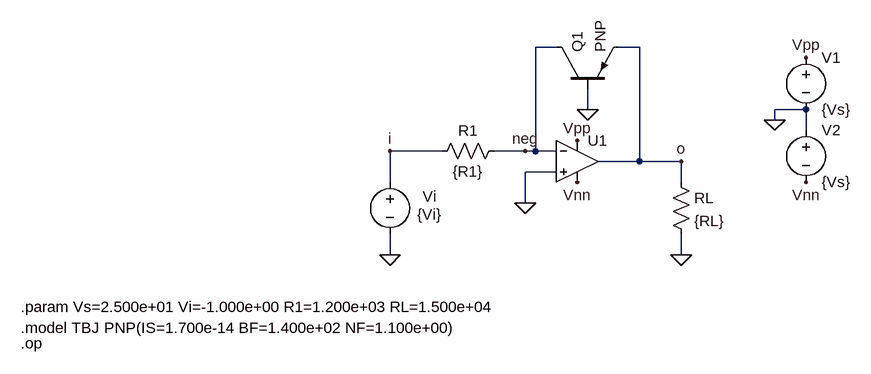
[diagram p0: schematic OPAMPTBJ02.asc]
OPAMPTBJ02.asc, the LTspice schematic file:
Version 4
SHEET 1 1608 1076
WIRE 672 240 640 240
WIRE 800 240 768 240
WIRE 720 336 720 304
WIRE 1056 336 1008 336
WIRE 1008 352 1008 336
WIRE 1056 368 1056 336
WIRE 496 400 416 400
WIRE 624 400 576 400
WIRE 640 400 640 240
WIRE 640 400 624 400
WIRE 672 400 640 400
WIRE 800 416 800 240
WIRE 800 416 736 416
WIRE 864 416 800 416
WIRE 672 432 624 432
WIRE 416 448 416 400
WIRE 864 448 864 416
WIRE 624 480 624 432
WIRE 416 560 416 528
WIRE 864 560 864 528
FLAG 1056 256 Vpp
FLAG 1008 352 0
FLAG 1056 448 Vnn
FLAG 864 560 0
FLAG 416 560 0
FLAG 704 384 Vpp
FLAG 704 448 Vnn
FLAG 624 480 0
FLAG 864 416 o
FLAG 416 400 i
FLAG 624 400 neg
FLAG 720 336 0
SYMBOL voltage 1056 240 R0
WINDOW 123 0 0 Left 0
WINDOW 39 0 0 Left 0
SYMATTR InstName V1
SYMATTR Value {Vs}
SYMBOL voltage 1056 352 R0
WINDOW 123 0 0 Left 0
WINDOW 39 0 0 Left 0
SYMATTR InstName V2
SYMATTR Value {Vs}
SYMBOL res 848 432 R0
SYMATTR InstName RL
SYMATTR Value {RL}
SYMBOL voltage 416 432 R0
WINDOW 3 42 66 Left 2
WINDOW 123 0 0 Left 0
WINDOW 39 0 0 Left 0
WINDOW 0 50 38 Left 2
SYMATTR Value {Vi}
SYMATTR InstName Vi
SYMBOL Opamps\\UniversalOpamp2 704 416 R0
SYMATTR InstName U1
SYMBOL res 480 416 R270
WINDOW 0 32 56 VTop 2
WINDOW 3 0 56 VBottom 2
SYMATTR InstName R1
SYMATTR Value {R1}
SYMBOL pnp 672 304 R270
SYMATTR InstName Q1
TEXT -152 696 Left 2 !.op
TEXT -152 640 Left 2 !.param Vs=2.500e+01 Vi=-1.000e+00 R1=1.200e+03 RL=1.500e+04
TEXT -152 672 Left 2 !.model TBJ PNP(IS=1.700e-14 BF=1.400e+02 NF=1.100e+00)

The netlist it stands for:
* OPAMPTBJ02.asc
V1 Vpp 0 {Vs}
V2 0 Vnn {Vs}
RL o 0 {RL}
Vi i 0 {Vi}
XU1 0 neg Vpp Vnn o level.2 Avol=1Meg GBW=10Meg Slew=10Meg ilimit=25m rail=0 Vos=0 phimargin=45 en=0 enk=0 in=0 ink=0 Rin=500Meg  ; pins IN+ IN- V+ V- OUT
R1 i neg {R1}
Q1 neg 0 o 0 PNP
.model NPN NPN
.model PNP PNP
.lib standard.bjt
.op
.param Vs=2.500e+01 Vi=-1.000e+00 R1=1.200e+03 RL=1.500e+04
.model TBJ PNP(IS=1.700e-14 BF=1.400e+02 NF=1.100e+00)
.lib UniversalOpamps2.sub
.backanno
.end